# Altium schematic sheet NG2092_Connector_A.SchDoc: =project_title
size Tabloid; CompanyName: Luxonis Holding; Organization: Luxonis Holding; Address1: 1925 Harmony Park Drive; Address2: Westminster, CO; Address3: 80234; Address4: United States; SheetNumber: 3; SheetTotal: 12
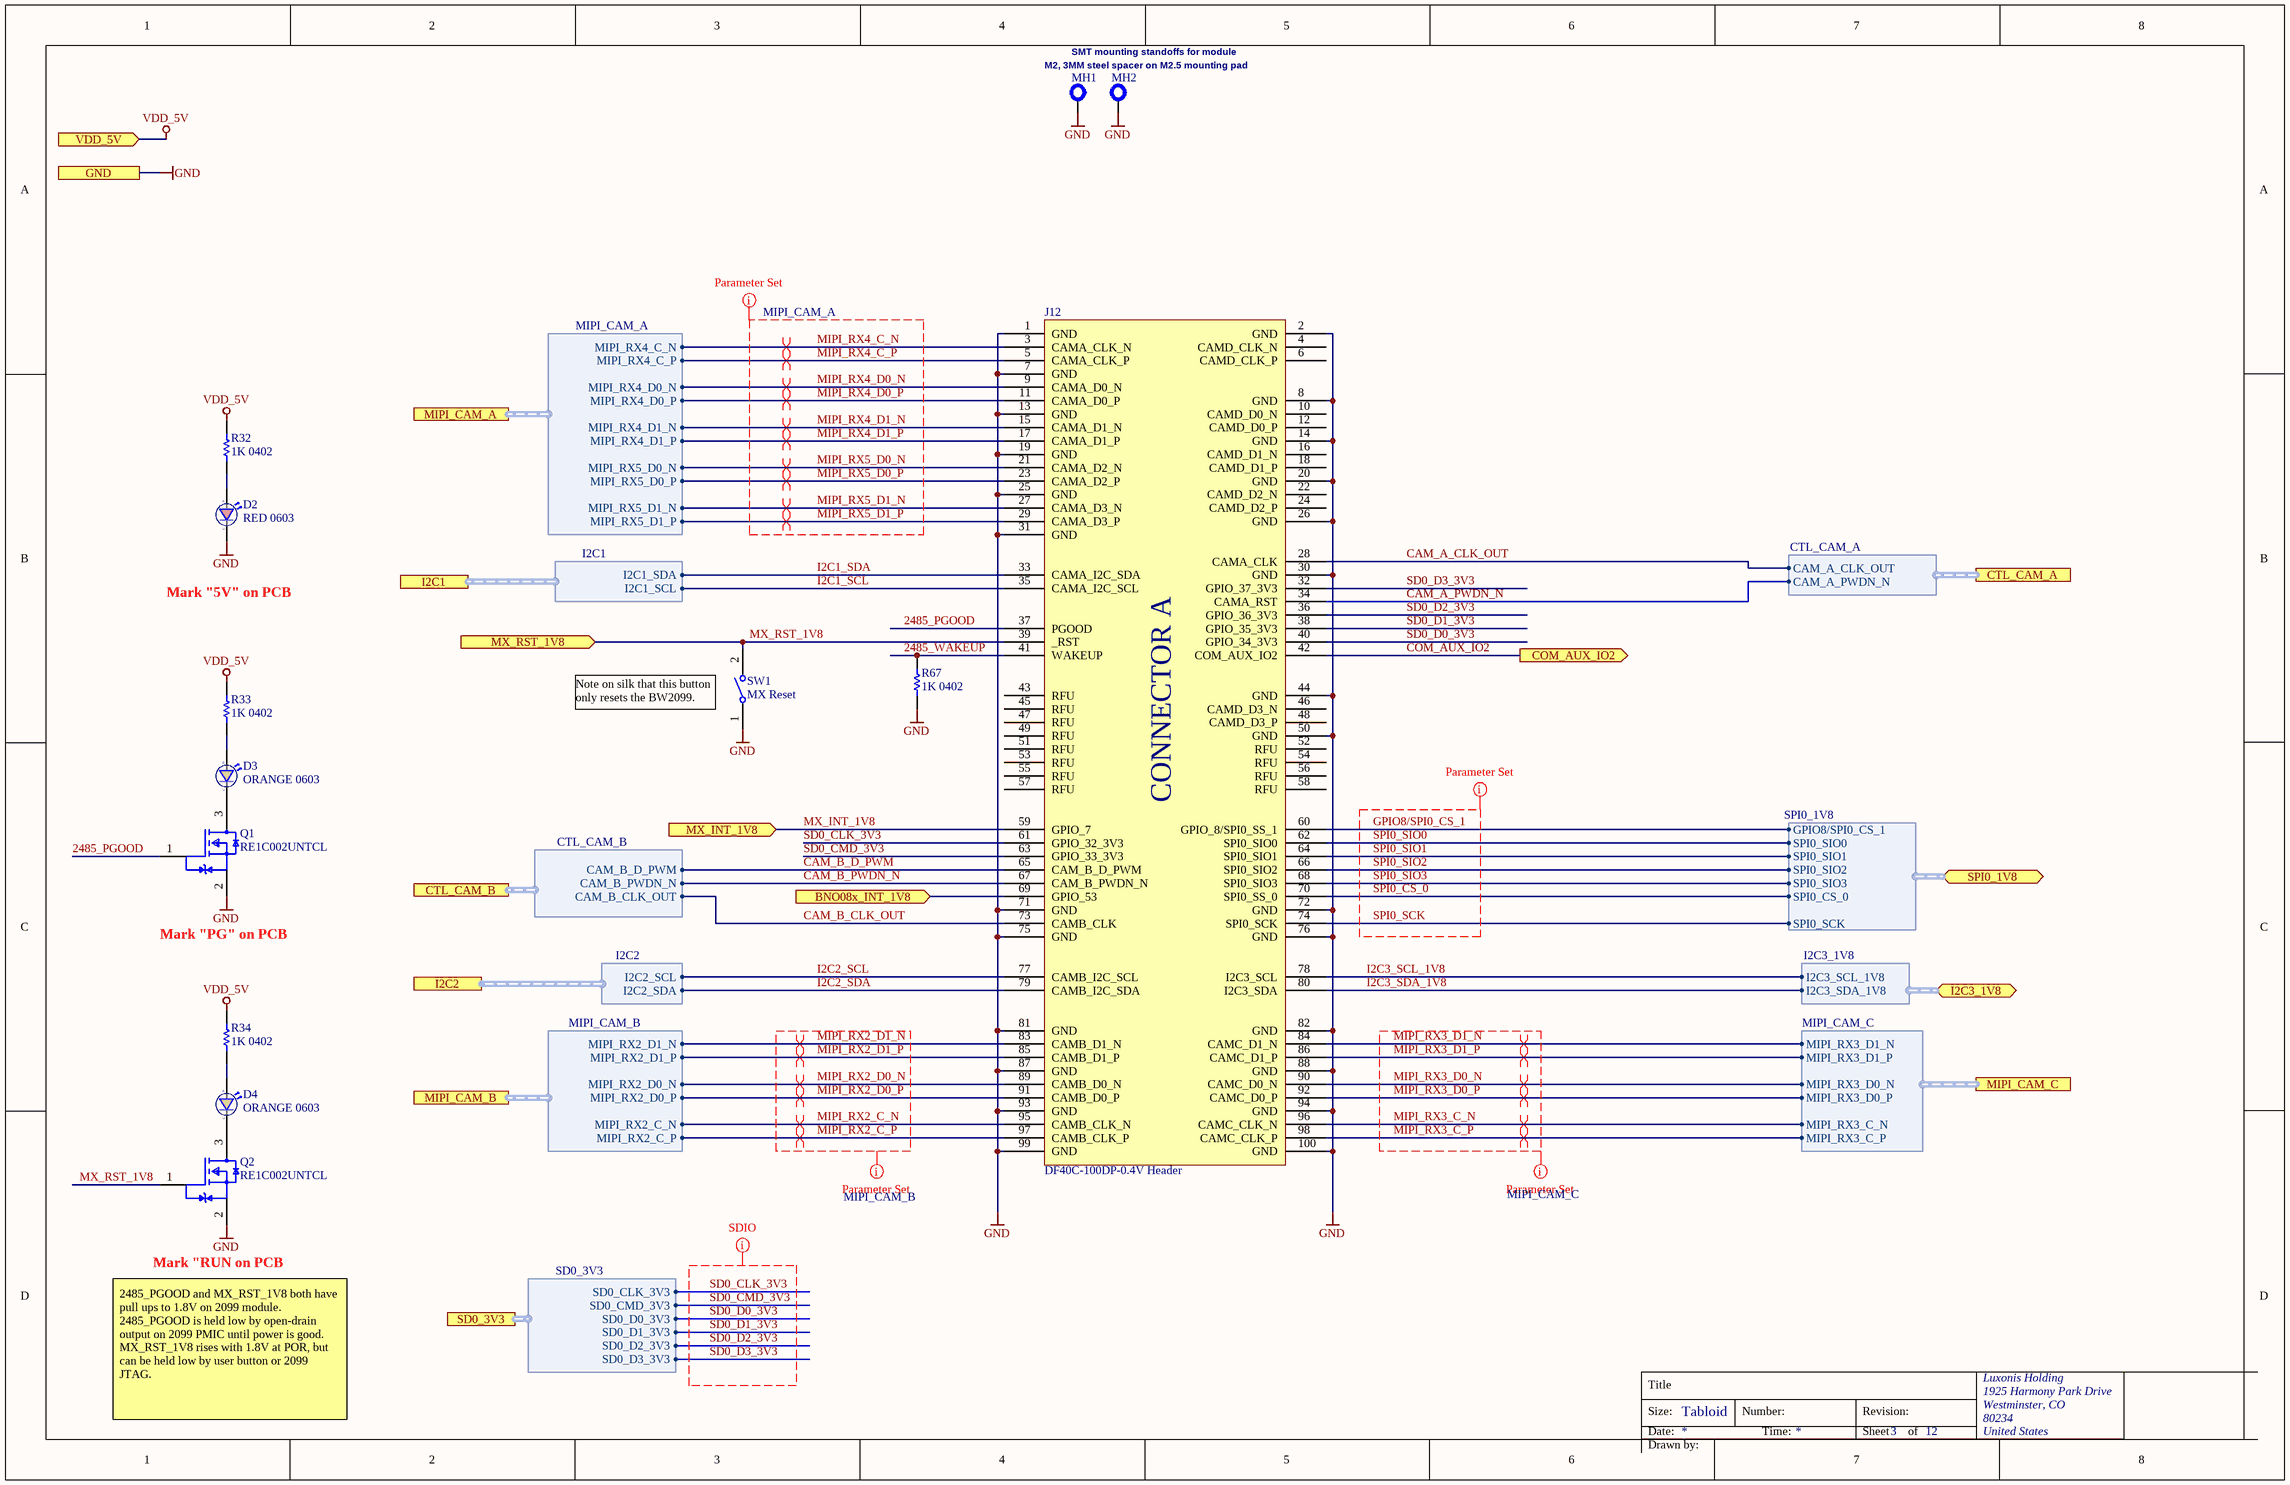
[diagram p0: NG2092_Connector_A.SchDoc]

## Parts
D2  RED 0603  [SML_D1xx8W]
D3  ORANGE 0603  [SML_D1xx8W]
D4  ORANGE 0603  [SML_D1xx8W]
J12  DF40C-100DP-0.4V Header  [CON_BW2099_A]
MH1  M2, 3MM steel spacer on M2.5 mounting pad  [9774030243R]  (value not drawn)
MH2  M2, 3MM steel spacer on M2.5 mounting pad  [9774030243R]  (value not drawn)
Q1  RE1C002UNTCL  [RE1C002UNTCL]
Q2  RE1C002UNTCL  [RE1C002UNTCL]
R32  1K 0402  [RESC0402(1005)_L]
R33  1K 0402  [RESC0402(1005)_L]
R34  1K 0402  [RESC0402(1005)_L]
R67  1K 0402  [RESC0402(1005)_L]
SW1  MX Reset  [OMRON-B3U-3000P_V]

## Ports
BNO08x_INT_1V8 (in), COM_AUX_IO2 (out), CTL_CAM_A (harness CTL_CAM_A), CTL_CAM_B (harness CTL_CAM_B), GND, I2C1 (harness I2C1), I2C2 (harness I2C2), I2C3_1V8 (bidir, harness I2C3_1V8), MIPI_CAM_A (harness MIPI_CAM_A), MIPI_CAM_B (harness MIPI_CAM_B), MIPI_CAM_C (harness MIPI_CAM_C), MX_INT_1V8 (in), MX_RST_1V8 (in), SD0_3V3 (harness SD0_3V3), SPI0_1V8 (bidir, harness SPI0_1V8), VDD_5V (in)

## Harnesses
MIPI_CAM_A: MIPI_RX4_C_P, MIPI_RX4_C_N, MIPI_RX4_D0_P, MIPI_RX4_D0_N, MIPI_RX4_D1_P, MIPI_RX4_D1_N, MIPI_RX5_D0_P, MIPI_RX5_D0_N, MIPI_RX5_D1_P, MIPI_RX5_D1_N
MIPI_CAM_B: MIPI_RX2_C_P, MIPI_RX2_C_N, MIPI_RX2_D0_P, MIPI_RX2_D0_N, MIPI_RX2_D1_P, MIPI_RX2_D1_N
MIPI_CAM_C: MIPI_RX3_C_P, MIPI_RX3_C_N, MIPI_RX3_D0_P, MIPI_RX3_D0_N, MIPI_RX3_D1_P, MIPI_RX3_D1_N
I2C1: I2C1_SDA, I2C1_SCL
CTL_CAM_B: CAM_B_CLK_OUT, CAM_B_PWDN_N, CAM_B_D_PWM
I2C2: I2C2_SDA, I2C2_SCL
I2C3_1V8: I2C3_SCL_1V8, I2C3_SDA_1V8
SPI0_1V8: SPI0_SIO1, SPI0_SIO2, SPI0_SIO3, GPIO8/SPI0_CS_1, SPI0_SIO0, SPI0_CS_0, SPI0_SCK
SD0_3V3: SD0_CLK_3V3, SD0_CMD_3V3, SD0_D0_3V3, SD0_D1_3V3, SD0_D2_3V3, SD0_D3_3V3
CTL_CAM_A: CAM_A_PWDN_N, CAM_A_CLK_OUT

## Nets
GND: D2.1(C) J12.1(GND) J12.2(GND) J12.7(GND) J12.8(GND) J12.13(GND) J12.14(GND) J12.19(GND) J12.20(GND) J12.25(GND) J12.26(GND) J12.30(GND) J12.31(GND) J12.44(GND) J12.50(GND) J12.71(GND) J12.72(GND) J12.75(GND) J12.76(GND) J12.81(GND) J12.82(GND) J12.87(GND) J12.88(GND) J12.93(GND) J12.94(GND) J12.99(GND) J12.100(GND) MH1.1 MH2.1 Q1.2(Source) Q2.2(Source) R67.1 SW1.1 ; port GND
VDD_5V: R32.2 R33.2 R34.2 ; port VDD_5V
2485_PGOOD: J12.37(PGOOD) Q1.1(Gate)
2485_WAKEUP: J12.41(WAKEUP) R67.2
BNO08x_INT_1V8: J12.69(GPIO_53) ; port BNO08x_INT_1V8
CAM_A_CLK_OUT: J12.28(CAMA_CLK) ; port CTL_CAM_A.CAM_A_CLK_OUT
CAM_A_PWDN_N: J12.34(CAMA_RST) ; port CTL_CAM_A.CAM_A_PWDN_N
CAM_B_CLK_OUT: J12.73(CAMB_CLK) ; port CTL_CAM_B.CAM_B_CLK_OUT
CAM_B_D_PWM: J12.65(CAM_B_D_PWM) ; port CTL_CAM_B.CAM_B_D_PWM
CAM_B_PWDN_N: J12.67(CAM_B_PWDN_N) ; port CTL_CAM_B.CAM_B_PWDN_N
COM_AUX_IO2: J12.42(COM_AUX_IO2) ; port COM_AUX_IO2
GPIO8/SPI0_CS_1: J12.60(GPIO_8/SPI0_SS_1) ; port SPI0_1V8.GPIO8/SPI0_CS_1
I2C1_SCL: J12.35(CAMA_I2C_SCL) ; port I2C1.I2C1_SCL
I2C1_SDA: J12.33(CAMA_I2C_SDA) ; port I2C1.I2C1_SDA
I2C2_SCL: J12.77(CAMB_I2C_SCL) ; port I2C2.I2C2_SCL
I2C2_SDA: J12.79(CAMB_I2C_SDA) ; port I2C2.I2C2_SDA
I2C3_SCL_1V8: J12.78(I2C3_SCL) ; port I2C3_1V8.I2C3_SCL_1V8
I2C3_SDA_1V8: J12.80(I2C3_SDA) ; port I2C3_1V8.I2C3_SDA_1V8
MIPI_RX2_C_N: J12.95(CAMB_CLK_N) ; port MIPI_CAM_B.MIPI_RX2_C_N
MIPI_RX2_C_P: J12.97(CAMB_CLK_P) ; port MIPI_CAM_B.MIPI_RX2_C_P
MIPI_RX2_D0_N: J12.89(CAMB_D0_N) ; port MIPI_CAM_B.MIPI_RX2_D0_N
MIPI_RX2_D0_P: J12.91(CAMB_D0_P) ; port MIPI_CAM_B.MIPI_RX2_D0_P
MIPI_RX2_D1_N: J12.83(CAMB_D1_N) ; port MIPI_CAM_B.MIPI_RX2_D1_N
MIPI_RX2_D1_P: J12.85(CAMB_D1_P) ; port MIPI_CAM_B.MIPI_RX2_D1_P
MIPI_RX3_C_N: J12.96(CAMC_CLK_N) ; port MIPI_CAM_C.MIPI_RX3_C_N
MIPI_RX3_C_P: J12.98(CAMC_CLK_P) ; port MIPI_CAM_C.MIPI_RX3_C_P
MIPI_RX3_D0_N: J12.90(CAMC_D0_N) ; port MIPI_CAM_C.MIPI_RX3_D0_N
MIPI_RX3_D0_P: J12.92(CAMC_D0_P) ; port MIPI_CAM_C.MIPI_RX3_D0_P
MIPI_RX3_D1_N: J12.84(CAMC_D1_N) ; port MIPI_CAM_C.MIPI_RX3_D1_N
MIPI_RX3_D1_P: J12.86(CAMC_D1_P) ; port MIPI_CAM_C.MIPI_RX3_D1_P
MIPI_RX4_C_N: J12.3(CAMA_CLK_N) ; port MIPI_CAM_A.MIPI_RX4_C_N
MIPI_RX4_C_P: J12.5(CAMA_CLK_P) ; port MIPI_CAM_A.MIPI_RX4_C_P
MIPI_RX4_D0_N: J12.9(CAMA_D0_N) ; port MIPI_CAM_A.MIPI_RX4_D0_N
MIPI_RX4_D0_P: J12.11(CAMA_D0_P) ; port MIPI_CAM_A.MIPI_RX4_D0_P
MIPI_RX4_D1_N: J12.15(CAMA_D1_N) ; port MIPI_CAM_A.MIPI_RX4_D1_N
MIPI_RX4_D1_P: J12.17(CAMA_D1_P) ; port MIPI_CAM_A.MIPI_RX4_D1_P
MIPI_RX5_D0_N: J12.21(CAMA_D2_N) ; port MIPI_CAM_A.MIPI_RX5_D0_N
MIPI_RX5_D0_P: J12.23(CAMA_D2_P) ; port MIPI_CAM_A.MIPI_RX5_D0_P
MIPI_RX5_D1_N: J12.27(CAMA_D3_N) ; port MIPI_CAM_A.MIPI_RX5_D1_N
MIPI_RX5_D1_P: J12.29(CAMA_D3_P) ; port MIPI_CAM_A.MIPI_RX5_D1_P
MX_INT_1V8: J12.59(GPIO_7) ; port MX_INT_1V8
MX_RST_1V8: J12.39(_RST) Q2.1(Gate) SW1.2 ; port MX_RST_1V8
SD0_CLK_3V3: J12.61(GPIO_32_3V3) ; port SD0_3V3.SD0_CLK_3V3
SD0_CMD_3V3: J12.63(GPIO_33_3V3) ; port SD0_3V3.SD0_CMD_3V3
SD0_D0_3V3: J12.40(GPIO_34_3V3) ; port SD0_3V3.SD0_D0_3V3
SD0_D1_3V3: J12.38(GPIO_35_3V3) ; port SD0_3V3.SD0_D1_3V3
SD0_D2_3V3: J12.36(GPIO_36_3V3) ; port SD0_3V3.SD0_D2_3V3
SD0_D3_3V3: J12.32(GPIO_37_3V3) ; port SD0_3V3.SD0_D3_3V3
SPI0_CS_0: J12.70(SPI0_SS_0) ; port SPI0_1V8.SPI0_CS_0
SPI0_SCK: J12.74(SPI0_SCK) ; port SPI0_1V8.SPI0_SCK
SPI0_SIO0: J12.62(SPI0_SIO0) ; port SPI0_1V8.SPI0_SIO0
SPI0_SIO1: J12.64(SPI0_SIO1) ; port SPI0_1V8.SPI0_SIO1
SPI0_SIO2: J12.66(SPI0_SIO2) ; port SPI0_1V8.SPI0_SIO2
SPI0_SIO3: J12.68(SPI0_SIO3) ; port SPI0_1V8.SPI0_SIO3
NetD2_2: D2.2(A) R32.1
NetD3_1: D3.1(C) Q1.3(Drain)
NetD3_2: D3.2(A) R33.1
NetD4_1: D4.1(C) Q2.3(Drain)
NetD4_2: D4.2(A) R34.1

Not connected (* = marked no-connect by the designer): J12 4(CAMD_CLK_N) 6(CAMD_CLK_P) 10(CAMD_D0_N) 12(CAMD_D0_P) 16(CAMD_D1_N) 18(CAMD_D1_P) 22(CAMD_D2_N) 24(CAMD_D2_P) 43(RFU) 45(RFU) 46(CAMD_D3_N) 47(RFU) 48(CAMD_D3_P) 49(RFU) 51(RFU) 52(RFU) 53(RFU) 54(RFU) 55(RFU) 56(RFU) 57(RFU) 58(RFU)

## Layout directives
net class MIPI_CAM_A; rule Matched Net Lengths [Delay Tolerance = 1ps]: MIPI_RX4_C_N, MIPI_RX4_C_P, MIPI_RX4_D0_N, MIPI_RX4_D0_P, MIPI_RX4_D1_N, MIPI_RX4_D1_P, MIPI_RX5_D0_N, MIPI_RX5_D0_P, MIPI_RX5_D1_N, MIPI_RX5_D1_P
differential pair; differential pair class 100ohm: MIPI_RX2_C_N, MIPI_RX2_C_P, MIPI_RX2_D0_N, MIPI_RX2_D0_P, MIPI_RX2_D1_N, MIPI_RX2_D1_P, MIPI_RX3_C_N, MIPI_RX3_C_P, MIPI_RX3_D0_N, MIPI_RX3_D0_P, MIPI_RX3_D1_N, MIPI_RX3_D1_P, MIPI_RX4_C_N, MIPI_RX4_C_P, MIPI_RX4_D0_N, MIPI_RX4_D0_P, MIPI_RX4_D1_N, MIPI_RX4_D1_P, MIPI_RX5_D0_N, MIPI_RX5_D0_P, MIPI_RX5_D1_N, MIPI_RX5_D1_P
net class MIPI_CAM_B; rule Matched Net Lengths [Delay Tolerance = 1ps]: MIPI_RX2_C_N, MIPI_RX2_C_P, MIPI_RX2_D0_N, MIPI_RX2_D0_P, MIPI_RX2_D1_N, MIPI_RX2_D1_P
net class MIPI_CAM_C; rule Matched Net Lengths [Delay Tolerance = 1ps]: MIPI_RX3_C_N, MIPI_RX3_C_P, MIPI_RX3_D0_N, MIPI_RX3_D0_P, MIPI_RX3_D1_N, MIPI_RX3_D1_P
net class SPI0: GPIO8/SPI0_CS_1, SPI0_CS_0, SPI0_SCK, SPI0_SIO0, SPI0_SIO1, SPI0_SIO2, SPI0_SIO3
net class SDIO: SD0_CLK_3V3, SD0_CMD_3V3, SD0_D0_3V3, SD0_D1_3V3, SD0_D2_3V3, SD0_D3_3V3

## Notes on the sheet
- M2, 3MM steel spacer on M2.5 mounting pad
- SMT mounting standoffs for module
- Mark "5V" on PCB
- (near SW1) Note on silk that this button only resets the BW2099.
- Mark "PG" on PCB
- Mark "RUN on PCB
- 2485_PGOOD and MX_RST_1V8 both have pull ups to 1.8V on 2099 module. 2485_PGOOD is held low by open-drain output on 2099 PMIC until power is good. MX_RST_1V8 rises with 1.8V at POR, but can be held low by user button or 2099 JTAG.
- Title
- Size:
- Date:
- Tabloid
- Number:
- Time:
- Revision:
- Sheet
- of
- Drawn by:
- (in symbol DF40C-100DP-0.4V_BW2099_A) CONNECTOR A

## Library data of the parts
D2 = SML-D12U8WT86: LED RED DIFFUSED 0603 SMD Red 620nm LED Indication - Discrete 2.2V 0603 (1608 Metric); Manufacturer 1: Rohm; Lens Color: White,Clear,Diffused; Lens Style: Rectangular,Diffused,Colorless; Forward Current: 20mA; Luminous Intensity: 63mcd; Number of LEDs: 1; Viewing Angle: 160°; RoHS: Yes; Mount: Surface Mount; Case/Package: 0603; Number of Pins: 2; Color: Red; Case Code (Metric): 1608; Case Code (Imperial): 0603; Min Operating Temperature: -40°C; Max Operating Temperature: 85°C; Forward Voltage: 2.2V; Packaging: Tape and Reel; Dominant Wavelength: 620nm; Wavelength: 620nm; Package Quantity: 1; Illumination Color: Red; Test Current: 20mA; Lens Transparency: Diffused; Length: 1.6mm; Height: 0.65mm; Width: 0.8mm; Radiation Hardening: No; REACH SVHC: No SVHC; Lead Free: Lead Free; ComponentLink1URL: https://datasheet.ciiva.com/11774/0900766b80df3ada-11774020.pdf?src-supplier=RSComponents; ComponentLink1Description: https://datasheet.ciiva.com/11774/0900766b80df3ada-11774020.pdf?src-supplier=RSComponents; ComponentLink2URL: https://datasheet.ciiva.com/2110/sml-d1-2110375.pdf?src-supplier=Digi-Key; ComponentLink2Description: https://datasheet.ciiva.com/2110/sml-d1-2110375.pdf?src-supplier=Digi-Key; ComponentLink3URL: https://datasheet.ciiva.com/2110/sml-d1-2110376.pdf?src-supplier=Digi-Key; ComponentLink3Description: https://datasheet.ciiva.com/2110/sml-d1-2110376.pdf?src-supplier=Digi-Key; ComponentLink4URL: https://datasheet.ciiva.com/2110/sml-d1-2110377.pdf?src-supplier=Digi-Key; ComponentLink4Description: https://datasheet.ciiva.com/2110/sml-d1-2110377.pdf?src-supplier=Digi-Key; ComponentLink5URL: https://datasheet.ciiva.com/9324/sml-d1-9324826.pdf?src-supplier=Avnet; ComponentLink5Description: https://datasheet.ciiva.com/9324/sml-d1-9324826.pdf?src-supplier=Avnet; ComponentLink6URL: https://datasheet.ciiva.com/17420/sml-d1-17420939.pdf?src-supplier=Avnet+Europe; ComponentLink6Description: https://datasheet.ciiva.com/17420/sml-d1-17420939.pdf?src-supplier=Avnet+Europe; Supplier 1: Digi-Key; Manufacturer Part Number 1: SML-D12U8WT86; Stock 1: 63748; Pricing 1: 1=0.33000, 10=0.23900, 100=0.11340, 500=0.07560, 1000=0.05922 (USD); Supplier Part Number 1: 511-1580-1-ND
D3 D4 = SML-D12D8WT86: LED ORANGE DIFFUSED 0603 SMD Orange 605nm LED Indication - Discrete 2.2V 0603 (1608 Metric); Manufacturer 1: Rohm; Lens Color: White; Lens Style: Diffused,Colorless,Rectangular; Number of LEDs: 1; Viewing Angle: 160°; Forward Current: 20mA; Luminous Intensity: 100mcd; Supplier 1: Digi-Key; Stock 1: 29355; Pricing 1: 1=0.33000, 10=0.23900, 100=0.11340, 500=0.07560, 1000=0.05922 (USD); RoHS: Yes; Mount: Surface Mount; Case/Package: 0603; Number of Pins: 2; Color: Orange; Case Code (Metric): 1608; Case Code (Imperial): 0603; Min Operating Temperature: -40°C; Max Operating Temperature: 85°C; Dominant Wavelength: 605nm; Forward Voltage: 2.2V; Package Quantity: 1; Packaging: Tape and Reel; Illumination Color: Orange; Test Current: 20mA; Lens Transparency: Diffused; Wavelength: 605nm; Length: 1.6mm; Height: 0.65mm; Width: 0.8mm; Radiation Hardening: No; REACH SVHC: Unknown; Lead Free: Lead Free; ComponentLink1URL: https://datasheet.ciiva.com/2115/sml-d1-2115577.pdf?src-supplier=Digi-Key; ComponentLink1Description: https://datasheet.ciiva.com/2115/sml-d1-2115577.pdf?src-supplier=Digi-Key; ComponentLink2URL: https://datasheet.ciiva.com/2115/sml-d1-2115578.pdf?src-supplier=Digi-Key; ComponentLink2Description: https://datasheet.ciiva.com/2115/sml-d1-2115578.pdf?src-supplier=Digi-Key; ComponentLink3URL: https://datasheet.ciiva.com/3161/sml-d1-3161418.pdf?src-supplier=Avnet; ComponentLink3Description: https://datasheet.ciiva.com/3161/sml-d1-3161418.pdf?src-supplier=Avnet; ComponentLink4URL: https://datasheet.ciiva.com/16387/sml-d1-16387850.pdf?src-supplier=Future+Electronics; ComponentLink4Description: https://datasheet.ciiva.com/16387/sml-d1-16387850.pdf?src-supplier=Future+Electronics; ComponentLink5URL: https://datasheet.ciiva.com/2115/sml-d1-2115579.pdf?src-supplier=Digi-Key; ComponentLink5Description: https://datasheet.ciiva.com/2115/sml-d1-2115579.pdf?src-supplier=Digi-Key; ComponentLink6URL: https://datasheet.ciiva.com/17419/sml-d1-17419886.pdf?src-supplier=Avnet+Europe; ComponentLink6Description: https://datasheet.ciiva.com/17419/sml-d1-17419886.pdf?src-supplier=Avnet+Europe; Supplier Part Number 1: 511-1577-1-ND; Manufacturer Part Number 1: SML-D12D8WT86
J12 = DF40C-100DP-0.4V_BW2099_A: CONN HDR 100POS 0.4MM SMD GOLD BW2099 SYMBOL; Manufacturer 1: Hirose; Manufacturer Part Number 1: DF40HC(3.0)-100DS-0.4V(51; pin_current: 0.3A; Voltage Rating: 30V; Connector Type: Receptacle; Number of Positions: 100; Stack Height: 1.5mm; pin_pitch: 0.4mm; mfg_pn: DF40C-100DP-0.4V; Supplier 1: Digi-Key; Stock 1: 2172; Pricing 1: 1=2.54000, 10=2.26000, 25=2.07000, 50=2.07000, 100=1.98000, 250=1.79000, 500=1.65000, 1000=1.41000, 3000=1.32000, 6000=1.23000, 10000=1.23000 (USD); RoHS: Yes; Mount: Surface Mount; Contact Plating: Gold; Min Operating Temperature: -35°C; Max Operating Temperature: 85°C; Number of Rows: 2; Termination: SMD/SMT; Package Quantity: 1000; Packaging: Tape and Reel; Orientation: Straight; Pitch: 0.4mm; Radiation Hardening: No; REACH SVHC: Unknown; Lead Free: Lead Free; ComponentLink1URL: https://datasheet.ciiva.com/46636/ed-df40-20140305-46636517.pdf?src-supplier=Digi-Key; ComponentLink1Description: https://datasheet.ciiva.com/46636/ed-df40-20140305-46636517.pdf?src-supplier=Digi-Key; ComponentLink2URL: https://datasheet.ciiva.com/18562/ed-df40-20140305-18562189.pdf?src-supplier=Digi-Key; ComponentLink2Description: https://datasheet.ciiva.com/18562/ed-df40-20140305-18562189.pdf?src-supplier=Digi-Key; ComponentLink3URL: https://datasheet.ciiva.com/13559/ed-df40-20140305-13559540.pdf?src-supplier=Mouser; ComponentLink3Description: https://datasheet.ciiva.com/13559/ed-df40-20140305-13559540.pdf?src-supplier=Mouser; ComponentLink4URL: https://datasheet.ciiva.com/18562/ed-df40-20140305-18562462.pdf?src-supplier=Digi-Key; ComponentLink4Description: https://datasheet.ciiva.com/18562/ed-df40-20140305-18562462.pdf?src-supplier=Digi-Key; Supplier Part Number 1: 798-DF40HC30100DS451; Supplier 2: Mouser; Supplier Part Number 2: 798-DF40HC30100DS458; Manufacturer 2: Hirose; Manufacturer Part Number 2: DF40HC(3.0)-100DS-0.4V(58)
MH1 MH2 = 9774030243R: MP ROUND STANDOFF M2X0.4 STEEL 3MM; Manufacturer 1: Wurth Electronics; Plating: Tin; Threaded/Unthreaded: Threaded; Outside Diameter: 0.171inch; Supplier 1: Digi-Key; Manufacturer Part Number 1: 9774030243R; Stock 1: 20568; Pricing 1: 1=0.95000, 10=0.91800, 50=0.79500, 100=0.73900 (USD); RoHS: Yes; Material: Steel; Length: 0.173inch; REACH SVHC: Unknown; ComponentLink1URL: http://www.mouser.com/ds/2/445/9774030243R-611455.pdf?src-supplier=Mouser; ComponentLink1Description: http://www.mouser.com/ds/2/445/9774030243R-611455.pdf?src-supplier=Mouser; ComponentLink2URL: http://www.farnell.com/datasheets/1960368.pdf?src-supplier=Farnell; ComponentLink2Description: http://www.farnell.com/datasheets/1960368.pdf?src-supplier=Farnell; ComponentLink3URL: https://katalog.we-online.de/em/datasheet/9774030243R.pdf?src-supplier=Digi-Key; ComponentLink3Description: https://katalog.we-online.de/em/datasheet/9774030243R.pdf?src-supplier=Digi-Key; ComponentLink4URL: http://www.farnell.com/datasheets/1960368.pdf?src-supplier=Newark; ComponentLink4Description: http://www.farnell.com/datasheets/1960368.pdf?src-supplier=Newark; ComponentLink5URL: http://www.farnell.com/datasheets/1960368.pdf?src-supplier=Element14; ComponentLink5Description: http://www.farnell.com/datasheets/1960368.pdf?src-supplier=Element14; Supplier Part Number 1: 732-7085-1-ND
Q1 Q2 = RE1C002UNTCL: MOSFET N-CH 20V 0.2A EMT3; Manufacturer 1: Rohm; Continuous Drain Current (ID): 200mA; Rds On Max: 1.2R; Input Capacitance: 25pF; Max Power Dissipation: 150mW; RoHS: Yes; Mount: Surface Mount; Case/Package: SOT-89; Packaging: Tape and Reel; Drain to Source Voltage (Vdss): 20V; Lead Free: Lead Free; ComponentLink1URL: http://www.mouser.com/ds/2/348/re1c002untcl-e-1018231.pdf?src-supplier=Mouser; ComponentLink1Description: http://www.mouser.com/ds/2/348/re1c002untcl-e-1018231.pdf?src-supplier=Mouser; ComponentLink2URL: http://rohmfs.rohm.com/en/techdata_basic/transistor/taping/EMT3_TL_taping.pdf?src-supplier=Digi-Key; ComponentLink2Description: http://rohmfs.rohm.com/en/techdata_basic/transistor/taping/EMT3_TL_taping.pdf?src-supplier=Digi-Key; ComponentLink3URL: http://rohmfs.rohm.com/en/products/databook/datasheet/discrete/transistor/mosfet/re1c002un.pdf?src-supplier=Avnet; ComponentLink3Description: http://rohmfs.rohm.com/en/products/databook/datasheet/discrete/transistor/mosfet/re1c002un.pdf?src-supplier=Avnet; ComponentLink4URL: https://www.rohm.com/datasheet/RE1C002UN/re1c002untcl-e?src-supplier=Digi-Key; ComponentLink4Description: https://www.rohm.com/datasheet/RE1C002UN/re1c002untcl-e?src-supplier=Digi-Key; ComponentLink5URL: http://www.farnell.com/datasheets/2704376.pdf?src-supplier=Newark; ComponentLink5Description: http://www.farnell.com/datasheets/2704376.pdf?src-supplier=Newark; ComponentLink6URL: http://www.farnell.com/datasheets/2704376.pdf?src-supplier=Farnell; ComponentLink6Description: http://www.farnell.com/datasheets/2704376.pdf?src-supplier=Farnell; ComponentLink7URL: http://www.farnell.com/datasheets/2704376.pdf?src-supplier=Element14; ComponentLink7Description: http://www.farnell.com/datasheets/2704376.pdf?src-supplier=Element14; Supplier 1: Digi-Key; Manufacturer Part Number 1: RE1C002UNTCL; Stock 1: 868886; Pricing 1: 1=0.20000, 10=0.18200, 100=0.09930, 500=0.06112, 1000=0.04167 (USD); Supplier Part Number 1: RE1C002UNTCLCT-ND
R32-R34 R67 = RC0402FR-071KL: RES SMD 1K OHM 1% 1/16W 0402; Manufacturer 1: Yageo; Temperature Coefficient: 100ppm/°C; Power Rating: 62.5mW; Voltage Rating (DC): 50V; Resistance: 1kR; RoHS: Yes; Number of Pins: 2; Case Code (Imperial): 0402; Case Code (Metric): 1005; Min Operating Temperature: -55°C; Max Operating Temperature: 155°C; Packaging: Tape and Reel; Composition: Thick Film; Voltage Rating: 50V; Military Standard: Not; Termination: SMD/SMT; Length: 1mm; Height: 0.32mm; Width: 0.5mm; Depth: 0.5mm; Lead Free: Lead Free; REACH SVHC: Unknown; ComponentLink1URL: https://datasheet.ciiva.com/11819/0900766b80c66297-11819477.pdf?src-supplier=RSComponents; ComponentLink1Description: https://datasheet.ciiva.com/11819/0900766b80c66297-11819477.pdf?src-supplier=RSComponents; ComponentLink2URL: https://datasheet.ciiva.com/12666/pyu-rc0402-51-rohs-l-6-r-12666741.pdf?src-supplier=Mouser; ComponentLink2Description: https://datasheet.ciiva.com/12666/pyu-rc0402-51-rohs-l-6-r-12666741.pdf?src-supplier=Mouser; ComponentLink3URL: https://datasheet.ciiva.com/17063/pyu-rc0402-51-rohs-l-6-r-17063193.pdf?src-supplier=Future+Electronics; ComponentLink3Description: https://datasheet.ciiva.com/17063/pyu-rc0402-51-rohs-l-6-r-17063193.pdf?src-supplier=Future+Electronics; ComponentLink4URL: https://datasheet.ciiva.com/22747/1018594-22747513.pdf?src-supplier=Element14; ComponentLink4Description: https://datasheet.ciiva.com/22747/1018594-22747513.pdf?src-supplier=Element14; ComponentLink5URL: https://datasheet.ciiva.com/7849/1018594-7849869.pdf?src-supplier=Element14; ComponentLink5Description: https://datasheet.ciiva.com/7849/1018594-7849869.pdf?src-supplier=Element14; ComponentLink6URL: https://datasheet.ciiva.com/7983/1018594-7983502.pdf?src-supplier=Element14; ComponentLink6Description: https://datasheet.ciiva.com/7983/1018594-7983502.pdf?src-supplier=Element14; ComponentLink7URL: https://datasheet.ciiva.com/7849/1018594-7849871.pdf?src-supplier=Element14; ComponentLink7Description: https://datasheet.ciiva.com/7849/1018594-7849871.pdf?src-supplier=Element14; Supplier 1: Digi-Key; Manufacturer Part Number 1: RC0402FR-071KL; Stock 1: 60695854; Pricing 1: 1=0.10000, 10=0.01600, 100=0.00670, 1000=0.00301, 2500=0.00261, 5000=0.00215 (USD); Case/Package: 0402; Tolerance: 1%; Supplier Part Number 1: 311-1.00KLRCT-ND
SW1 = CMP-1677-00003-1: Keypad Switch, 1 Switches, SPST, Momentary-tactile, 0.05A, 12VDC, 2.08N, Solder Terminal, Surface Mount-right Angle; Manufacturer 1: Omron; Manufacturer Part Number 1: B3U-3000P; ComponentLink2Description: https://datasheet.ciiva.com/1634/60838-1634400.pdf?src-supplier=Farnell; ComponentLink1URL: https://datasheet.ciiva.com:443/pdfs/VipMasterIC/IC/OMRN/OMRN-S-A0001309783/OMRN-S-A0001309783-1.pdf?src-supplier=IHS+Markit; ComponentLink2URL: https://datasheet.ciiva.com/1634/60838-1634400.pdf?src-supplier=Farnell; ComponentLink1Description: https://datasheet.ciiva.com:443/pdfs/VipMasterIC/IC/OMRN/OMRN-S-A0001309783/OMRN-S-A0001309783-1.pdf?src-supplier=IHS+Markit; Supplier 1: Digi-Key; RoHS: Yes; Category: Tactile Switches; ComponentLink3URL: https://datasheet.ciiva.com/2900/b3u-1110-2900035.pdf?src-supplier=Digi-Key; ComponentLink3Description: https://datasheet.ciiva.com/2900/b3u-1110-2900035.pdf?src-supplier=Digi-Key; ComponentLink4URL: https://datasheet.ciiva.com/2900/b3u-1110-2900036.pdf?src-supplier=Digi-Key; ComponentLink4Description: https://datasheet.ciiva.com/2900/b3u-1110-2900036.pdf?src-supplier=Digi-Key; ComponentLink5URL: https://datasheet.ciiva.com/2900/b3u-1110-2900037.pdf?src-supplier=Digi-Key; ComponentLink5Description: https://datasheet.ciiva.com/2900/b3u-1110-2900037.pdf?src-supplier=Digi-Key; ComponentLink6URL: https://datasheet.ciiva.com/1532/60838-1532682.pdf?src-supplier=Element14; ComponentLink6Description: https://datasheet.ciiva.com/1532/60838-1532682.pdf?src-supplier=Element14; ComponentLink7URL: https://datasheet.ciiva.com/16863/70176037-16863994.pdf?src-supplier=Allied+Electronics; ComponentLink7Description: https://datasheet.ciiva.com/16863/70176037-16863994.pdf?src-supplier=Allied+Electronics; ComponentLink8URL: https://datasheet.ciiva.com/14142/b3u-eng-datasheet-14142542.pdf?src-supplier=Distrelec; ComponentLink8Description: https://datasheet.ciiva.com/14142/b3u-eng-datasheet-14142542.pdf?src-supplier=Distrelec; ComponentLink9URL: https://datasheet.ciiva.com/30158/en-b3u-30158606.pdf?src-supplier=Onlinecomponents.com; ComponentLink9Description: https://datasheet.ciiva.com/30158/en-b3u-30158606.pdf?src-supplier=Onlinecomponents.com; Stock 1: 20017; Pricing 1: 1=0,96000, 10=0,92700, 25=0,86640, 100=0,75220, 250=0,68448, 500=0,63456, 1000=0,62388 (USD); Supplier Part Number 1: SW1022CT-ND